# EAGLE design v.0.0.0 (EAGLE 5.11)

## Sheet 1 of 4
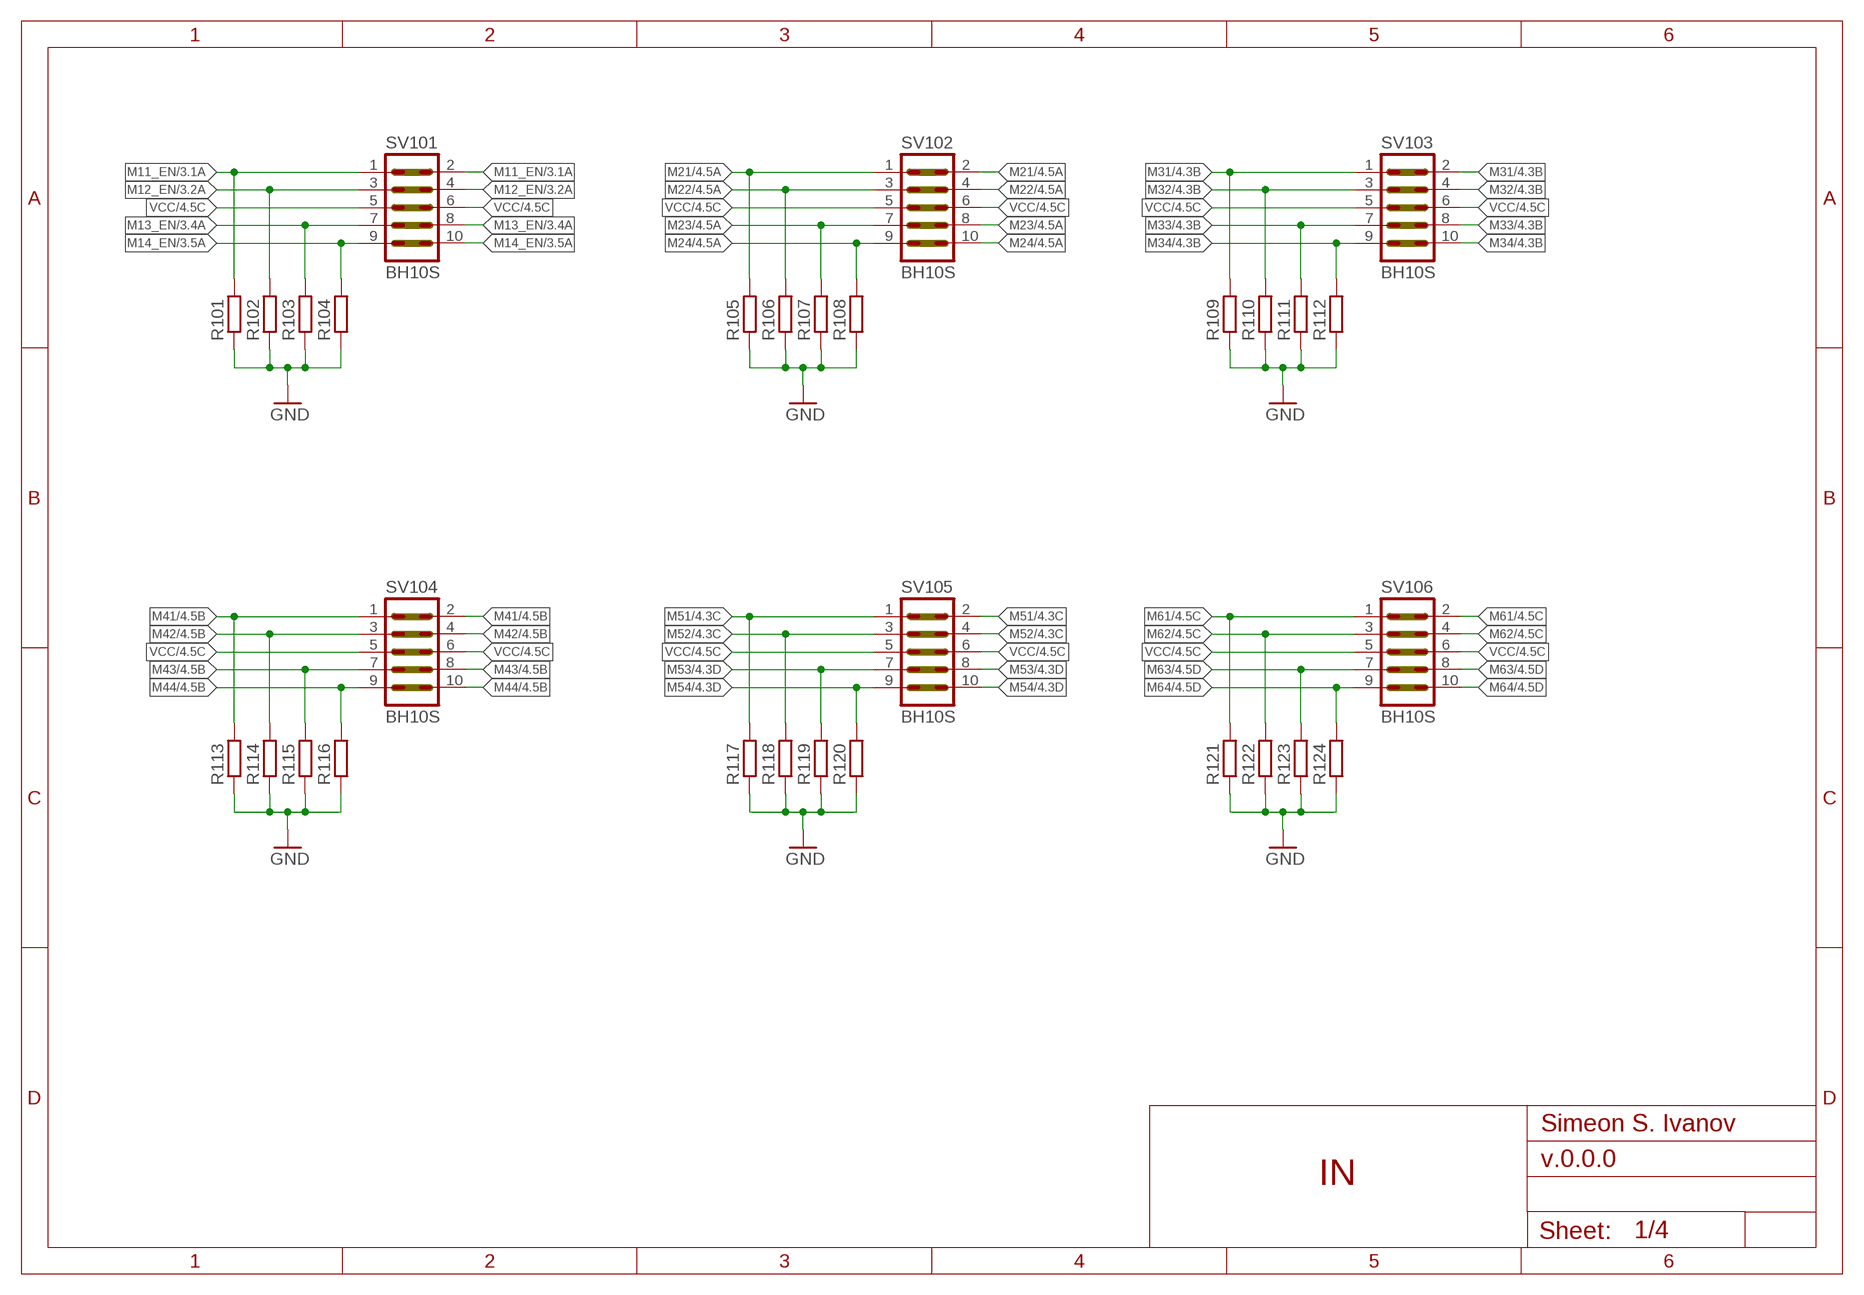
[diagram p0: schematic, sheet 1]

### Parts
R101  R-EU_0204/5  [0204/5]
R102  R-EU_0204/5  [0204/5]
R103  R-EU_0204/5  [0204/5]
R104  R-EU_0204/5  [0204/5]
R105  R-EU_0204/5  [0204/5]
R106  R-EU_0204/5  [0204/5]
R107  R-EU_0204/5  [0204/5]
R108  R-EU_0204/5  [0204/5]
R109  R-EU_0204/5  [0204/5]
R110  R-EU_0204/5  [0204/5]
R111  R-EU_0204/5  [0204/5]
R112  R-EU_0204/5  [0204/5]
R113  R-EU_0204/5  [0204/5]
R114  R-EU_0204/5  [0204/5]
R115  R-EU_0204/5  [0204/5]
R116  R-EU_0204/5  [0204/5]
R117  R-EU_0204/5  [0204/5]
R118  R-EU_0204/5  [0204/5]
R119  R-EU_0204/5  [0204/5]
R120  R-EU_0204/5  [0204/5]
R121  R-EU_0204/5  [0204/5]
R122  R-EU_0204/5  [0204/5]
R123  R-EU_0204/5  [0204/5]
R124  R-EU_0204/5  [0204/5]
SV101  BH10S  ML10M10-HOME  [M10-HOME]
SV102  BH10S  ML10M10-HOME  [M10-HOME]
SV103  BH10S  ML10M10-HOME  [M10-HOME]
SV104  BH10S  ML10M10-HOME  [M10-HOME]
SV105  BH10S  ML10M10-HOME  [M10-HOME]
SV106  BH10S  ML10M10-HOME  [M10-HOME]

### Nets
GND: R101.1 R102.1 R103.1 R104.1 R105.1 R106.1 R107.1 R108.1 R109.1 R110.1 R111.1 R112.1 R113.1 R114.1 R115.1 R116.1 R117.1 R118.1 R119.1 R120.1 R121.1 R122.1 R123.1 R124.1 ; also sheet 2,3,4
M11_EN: R101.2 SV101.1 SV101.2 ; also sheet 3
M12_EN: R102.2 SV101.3 SV101.4 ; also sheet 3
M13_EN: R103.2 SV101.7 SV101.8 ; also sheet 3
M14_EN: R104.2 SV101.9 SV101.10 ; also sheet 3
M21: R105.2 SV102.1 SV102.2 ; also sheet 4
M22: R106.2 SV102.3 SV102.4 ; also sheet 4
M23: R107.2 SV102.7 SV102.8 ; also sheet 4
M24: R108.2 SV102.9 SV102.10 ; also sheet 4
M31: R109.2 SV103.1 SV103.2 ; also sheet 4
M32: R110.2 SV103.3 SV103.4 ; also sheet 4
M33: R111.2 SV103.7 SV103.8 ; also sheet 4
M34: R112.2 SV103.9 SV103.10 ; also sheet 4
M41: R113.2 SV104.1 SV104.2 ; also sheet 4
M42: R114.2 SV104.3 SV104.4 ; also sheet 4
M43: R115.2 SV104.7 SV104.8 ; also sheet 4
M44: R116.2 SV104.9 SV104.10 ; also sheet 4
M51: R117.2 SV105.1 SV105.2 ; also sheet 4
M52: R118.2 SV105.3 SV105.4 ; also sheet 4
M53: R119.2 SV105.7 SV105.8 ; also sheet 4
M54: R120.2 SV105.9 SV105.10 ; also sheet 4
M61: R121.2 SV106.1 SV106.2 ; also sheet 4
M62: R122.2 SV106.3 SV106.4 ; also sheet 4
M63: R123.2 SV106.7 SV106.8 ; also sheet 4
M64: R124.2 SV106.9 SV106.10 ; also sheet 4
VCC: SV101.5 SV101.6 SV102.5 SV102.6 SV103.5 SV103.6 SV104.5 SV104.6 SV105.5 SV105.6 SV106.5 SV106.6 ; also sheet 4

### Notes on the sheet
- Simeon S. Ivanov
- IN

## Sheet 2 of 4
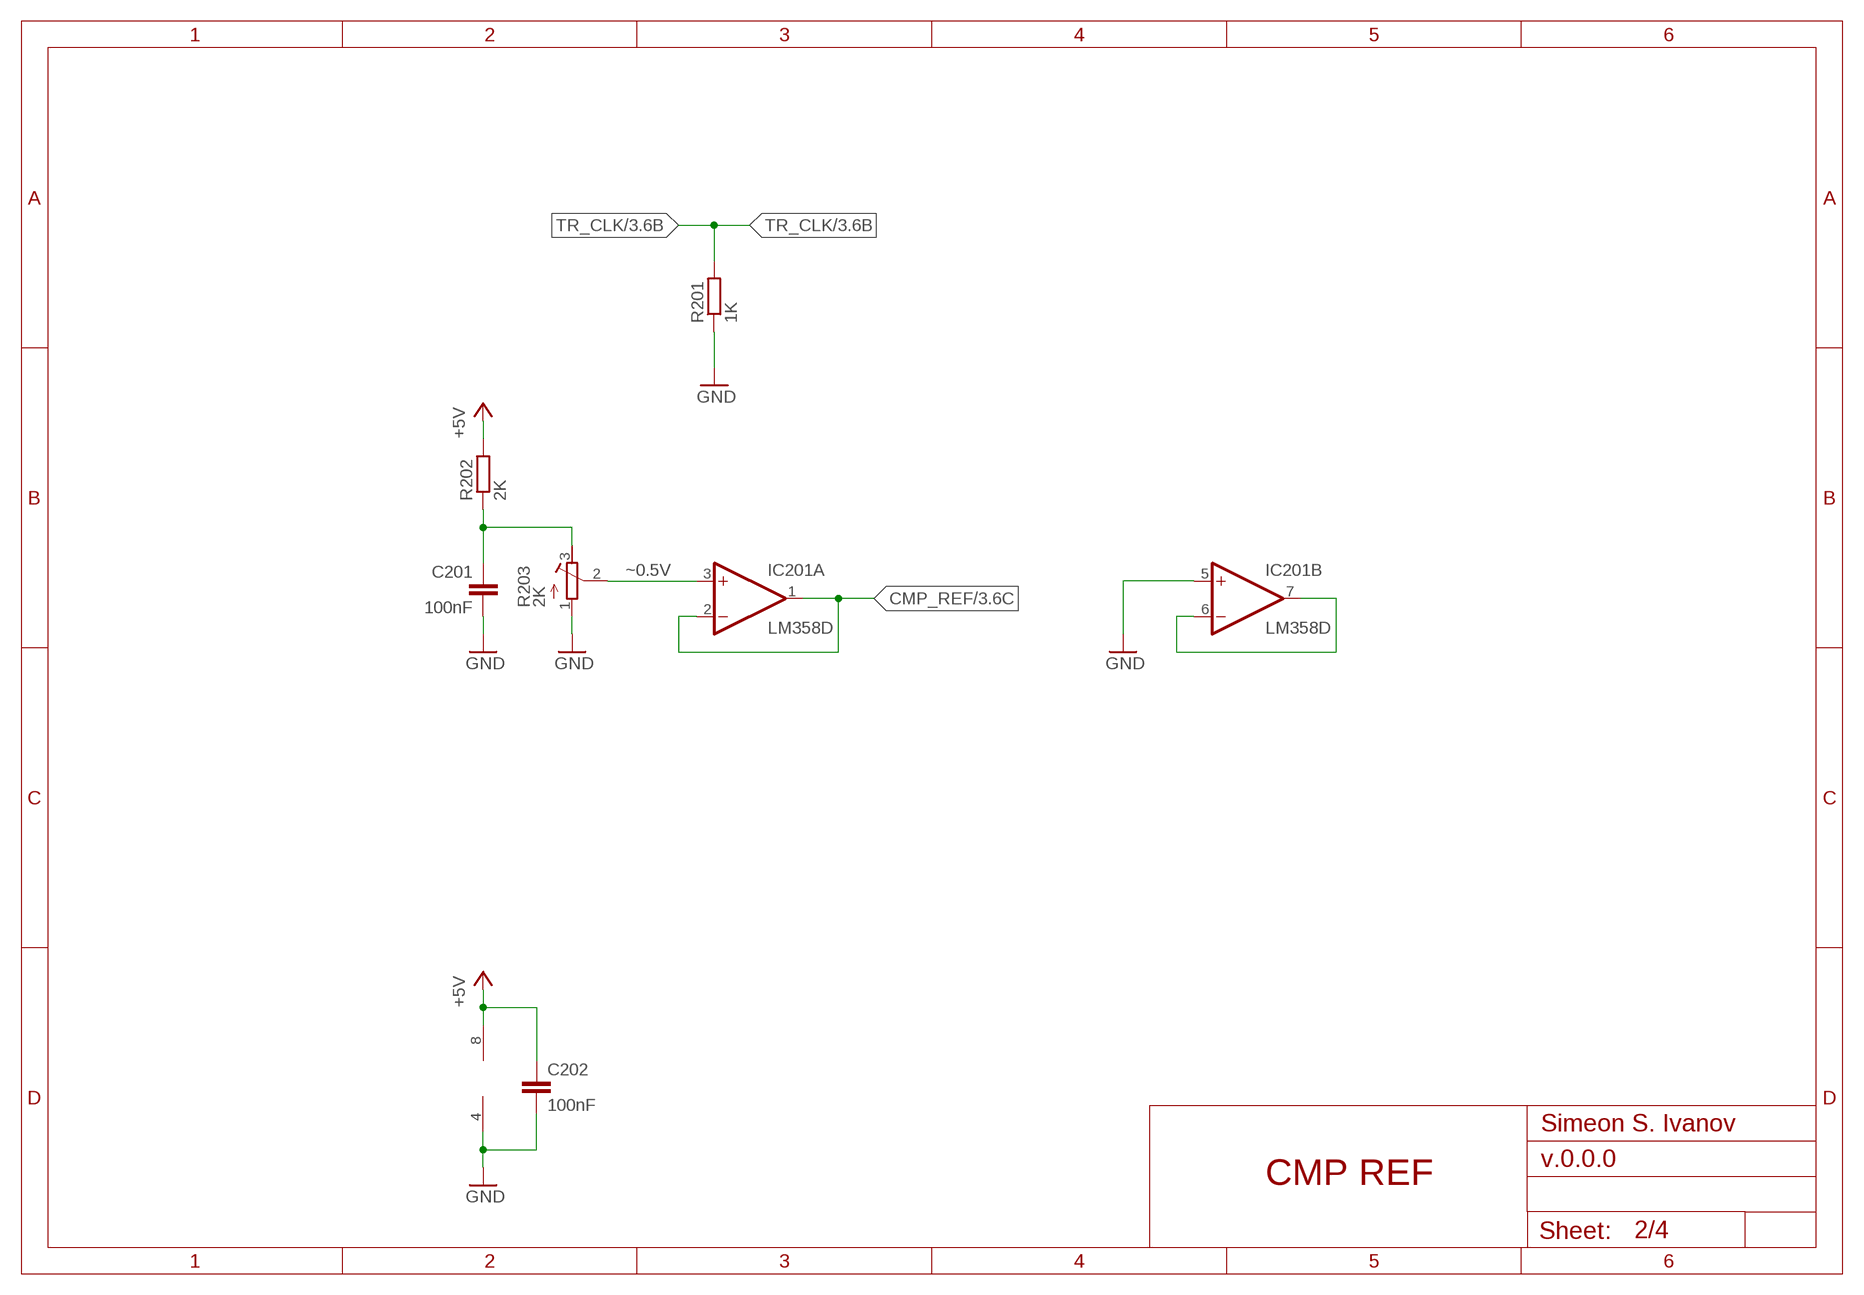
[diagram p1: schematic, sheet 2]

### Parts
C201  100nF  C-EUC1206  [C1206]
C202  100nF  C-EUC0603  [C0603]
IC201  LM358D  [SO08]
R201  1K  R-EU_0411/3V  [0411V]
R202  2K  R-EU_0204/5  [0204/5]
R203  2K  R-TRIMM3296W  [RTRIM3296W]

### Nets
+5V: C202.1 IC201.8(P:V+) R202.2 ; also sheet 3
CMP_REF: IC201.1(A:OUT) IC201.2(A:-IN) ; also sheet 3
GND: C201.2 C202.2 IC201.4(P:V-) IC201.5(B:+IN) R201.1 R203.1(E) ; also sheet 1,3,4
N$1: C201.1 R202.1 R203.3(A)
N$3: IC201.6(B:-IN) IC201.7(B:OUT)
TR_CLK: R201.2 ; also sheet 3
~0.5V: IC201.3(A:+IN) R203.2(S)

### Notes on the sheet
- Simeon S. Ivanov
- CMP REF

## Sheet 3 of 4
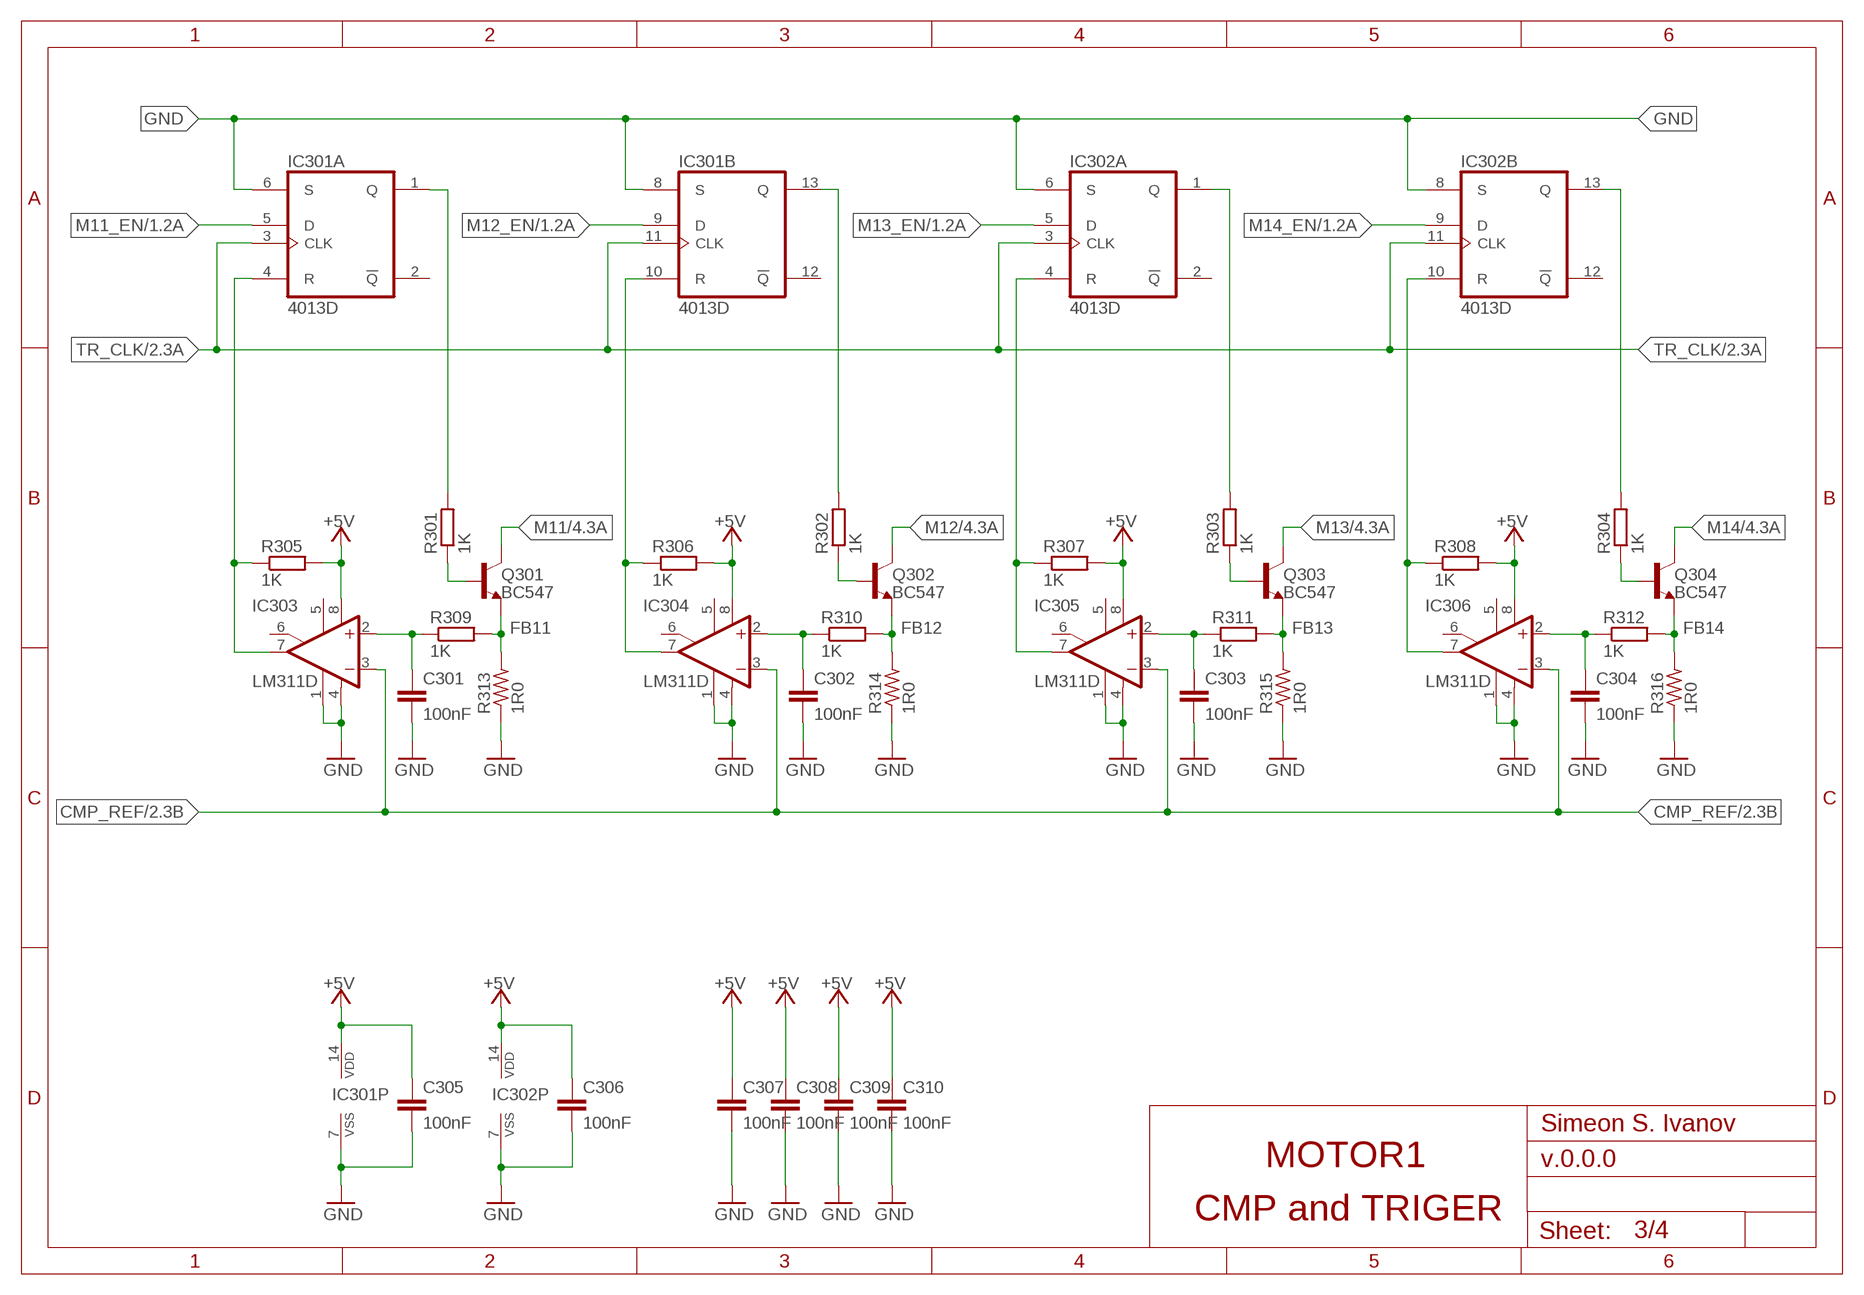
[diagram p2: schematic, sheet 3]

### Parts
C301  100nF  C-EUC0805  [C0805]
C302  100nF  C-EUC0805  [C0805]
C303  100nF  C-EUC0805  [C0805]
C304  100nF  C-EUC0805  [C0805]
C305  100nF  C-EUC0603  [C0603]
C306  100nF  C-EUC0603  [C0603]
C307  100nF  C-EUC0603  [C0603]
C308  100nF  C-EUC0603  [C0603]
C309  100nF  C-EUC0603  [C0603]
C310  100nF  C-EUC0603  [C0603]
IC301  4013D  [SO14]
IC302  4013D  [SO14]
IC303  LM311D  [SO08]
IC304  LM311D  [SO08]
IC305  LM311D  [SO08]
IC306  LM311D  [SO08]
Q301  BC547  [TO92]
Q302  BC547  [TO92]
Q303  BC547  [TO92]
Q304  BC547  [TO92]
R301  1K  R-EU_0204/5  [0204/5]
R302  1K  R-EU_0204/5  [0204/5]
R303  1K  R-EU_0204/5  [0204/5]
R304  1K  R-EU_0204/5  [0204/5]
R305  1K  R-EU_R0603  [R0603]
R306  1K  R-EU_R0603  [R0603]
R307  1K  R-EU_R0603  [R0603]
R308  1K  R-EU_R0603  [R0603]
R309  1K  R-EU_0204/2V  [0204V]
R310  1K  R-EU_0204/2V  [0204V]
R311  1K  R-EU_0204/2V  [0204V]
R312  1K  R-EU_0204/2V  [0204V]
R313  1R0  R-US_0204/5  [0204/5]
R314  1R0  R-US_0204/5  [0204/5]
R315  1R0  R-US_0204/5  [0204/5]
R316  1R0  R-US_0204/5  [0204/5]

### Nets
+5V: C305.1 C306.1 C307.1 C308.1 C309.1 C310.1 IC301.14(P:VDD) IC302.14(P:VDD) IC303.8(V+) IC304.8(V+) IC305.8(V+) IC306.8(V+) R305.2 R306.2 R307.2 R308.2 ; also sheet 2
CMP_REF: IC303.3(-IN) IC304.3(-IN) IC305.3(-IN) IC306.3(-IN) ; also sheet 2
FB11: Q301.1(E) R309.2 R313.2
FB12: Q302.1(E) R310.2 R314.2
FB13: Q303.1(E) R311.2 R315.2
FB14: Q304.1(E) R312.2 R316.2
GND: C301.2 C302.2 C303.2 C304.2 C305.2 C306.2 C307.2 C308.2 C309.2 C310.2 IC301.6(A:S) IC301.7(P:VSS) IC301.8(B:S) IC302.6(A:S) IC302.7(P:VSS) IC302.8(B:S) IC303.1(GND) IC303.4(V-) IC304.1(GND) IC304.4(V-) IC305.1(GND) IC305.4(V-) IC306.1(GND) IC306.4(V-) R313.1 R314.1 R315.1 R316.1 ; also sheet 1,2,4
M11: Q301.3(C) ; also sheet 4
M11_EN: IC301.5(A:D) ; also sheet 1
M12: Q302.3(C) ; also sheet 4
M12_EN: IC301.9(B:D) ; also sheet 1
M13: Q303.3(C) ; also sheet 4
M13_EN: IC302.5(A:D) ; also sheet 1
M14: Q304.3(C) ; also sheet 4
M14_EN: IC302.9(B:D) ; also sheet 1
N$5: IC301.10(B:R) IC304.7(OUT) R306.1
N$7: Q301.2(B) R301.1
N$8: IC301.13(B:Q) R302.2
N$9: IC301.1(A:Q) R301.2
N$10: IC301.4(A:R) IC303.7(OUT) R305.1
N$11: Q302.2(B) R302.1
N$12: Q304.2(B) R304.1
N$13: Q303.2(B) R303.1
N$14: IC302.13(B:Q) R304.2
N$15: IC302.10(B:R) IC306.7(OUT) R308.1
N$16: IC302.1(A:Q) R303.2
N$17: C304.1 IC306.2(+IN) R312.1
N$18: IC302.4(A:R) IC305.7(OUT) R307.1
N$19: C303.1 IC305.2(+IN) R311.1
N$20: C302.1 IC304.2(+IN) R310.1
N$22: C301.1 IC303.2(+IN) R309.1
TR_CLK: IC301.3(A:CLK) IC301.11(B:CLK) IC302.3(A:CLK) IC302.11(B:CLK) ; also sheet 2
Unconnected: IC301.2(A:!Q) IC301.12(B:!Q) IC302.2(A:!Q) IC302.12(B:!Q) IC303.5(ON) IC303.6(ON/STR) IC304.5(ON) IC304.6(ON/STR) IC305.5(ON) IC305.6(ON/STR) IC306.5(ON) IC306.6(ON/STR)

### Notes on the sheet
- Simeon S. Ivanov
- MOTOR1
- CMP and TRIGER

## Sheet 4 of 4
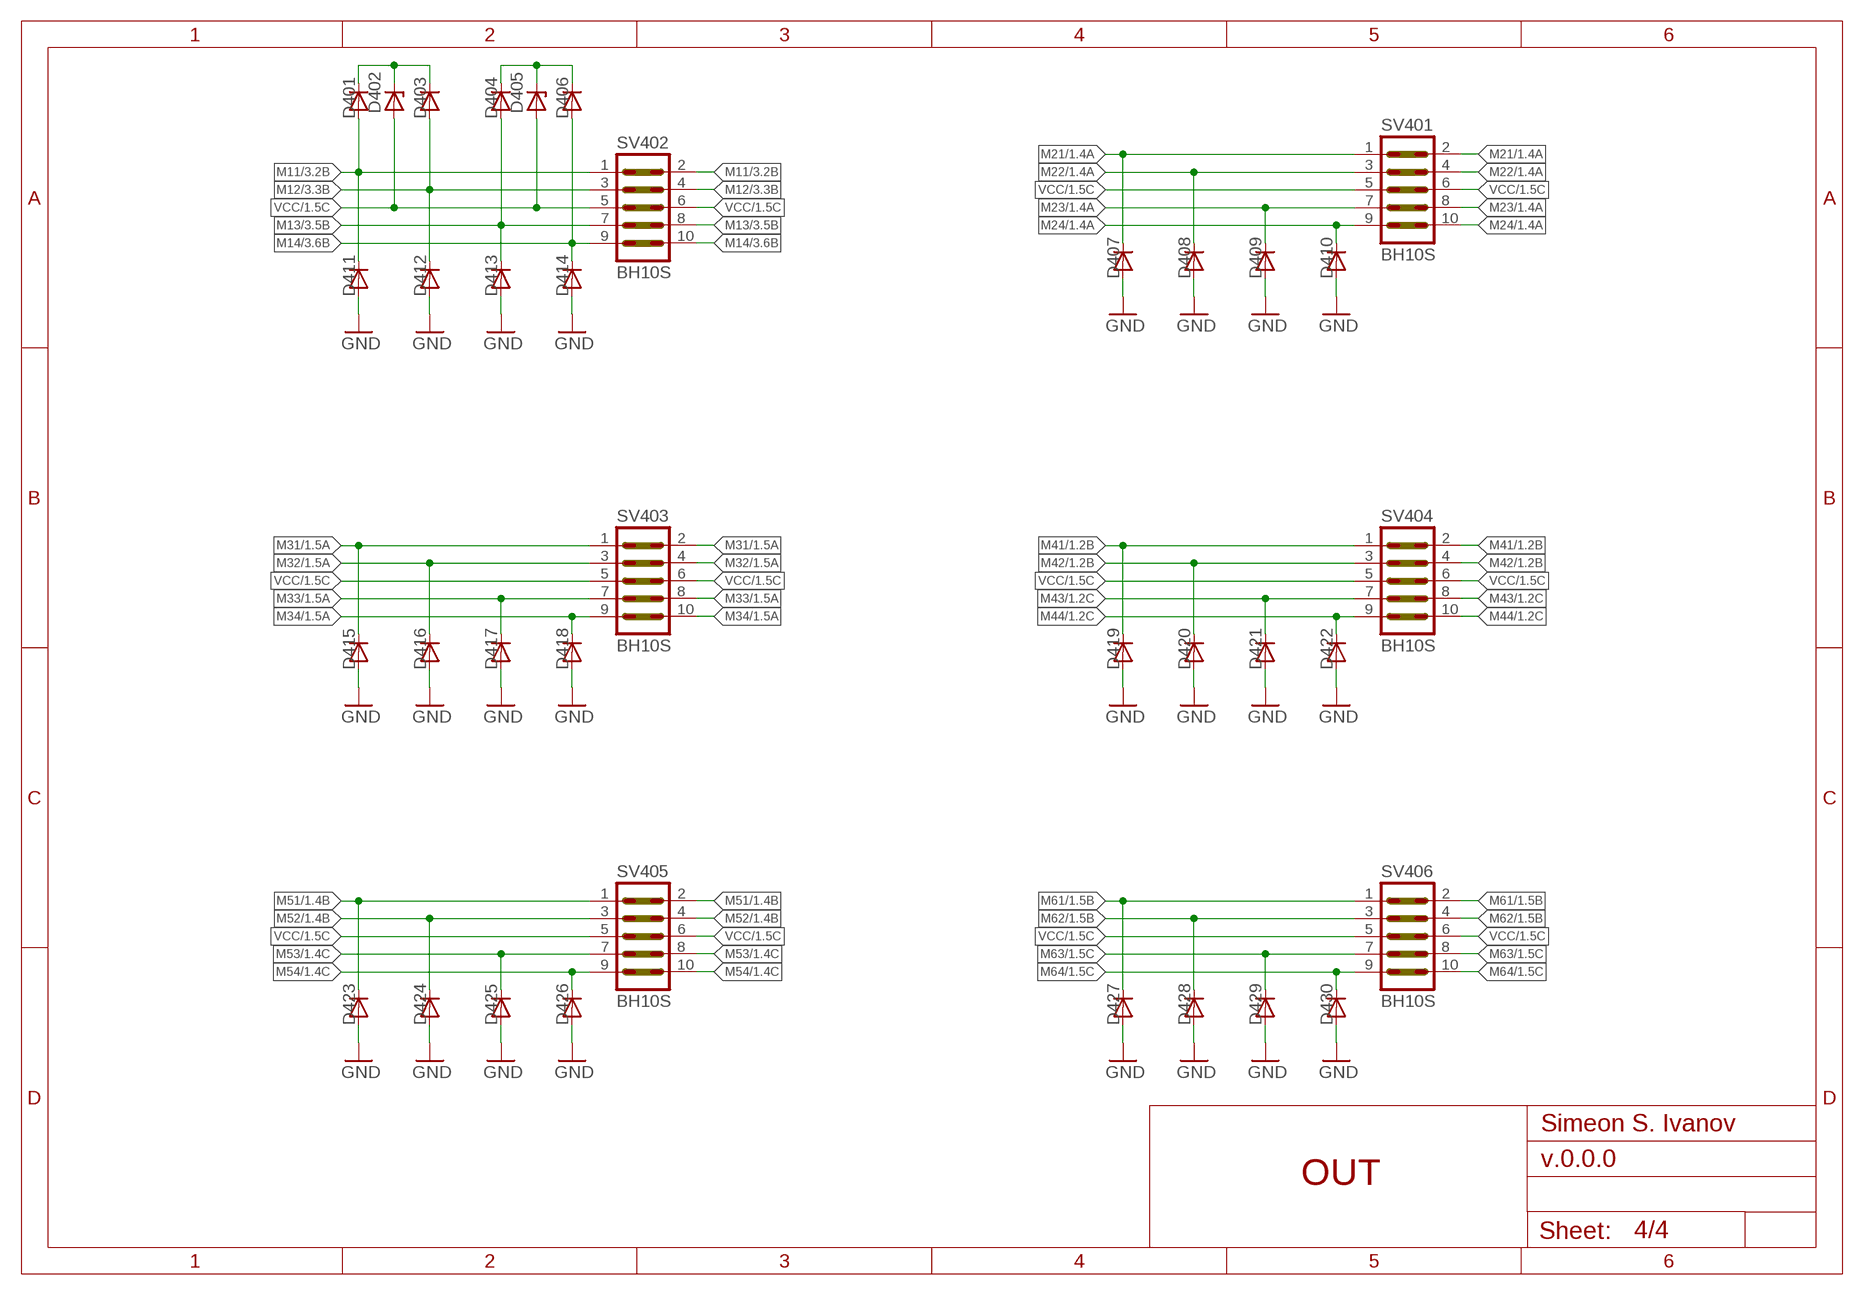
[diagram p3: schematic, sheet 4]

### Parts
D401  DIODE-D-2.5  [D-2.5]
D402  ZENER-DIODEZD-2.5  [ZDIO-2.5]
D403  DIODE-D-2.5  [D-2.5]
D404  DIODE-D-2.5  [D-2.5]
D405  ZENER-DIODEZD-2.5  [ZDIO-2.5]
D406  DIODE-D-2.5  [D-2.5]
D407  DIODE-D-2.5  [D-2.5]
D408  DIODE-D-2.5  [D-2.5]
D409  DIODE-D-2.5  [D-2.5]
D410  DIODE-D-2.5  [D-2.5]
D411  DIODE-D-2.5  [D-2.5]
D412  DIODE-D-2.5  [D-2.5]
D413  DIODE-D-2.5  [D-2.5]
D414  DIODE-D-2.5  [D-2.5]
D415  DIODE-D-2.5  [D-2.5]
D416  DIODE-D-2.5  [D-2.5]
D417  DIODE-D-2.5  [D-2.5]
D418  DIODE-D-2.5  [D-2.5]
D419  DIODE-D-2.5  [D-2.5]
D420  DIODE-D-2.5  [D-2.5]
D421  DIODE-D-2.5  [D-2.5]
D422  DIODE-D-2.5  [D-2.5]
D423  DIODE-D-2.5  [D-2.5]
D424  DIODE-D-2.5  [D-2.5]
D425  DIODE-D-2.5  [D-2.5]
D426  DIODE-D-2.5  [D-2.5]
D427  DIODE-D-2.5  [D-2.5]
D428  DIODE-D-2.5  [D-2.5]
D429  DIODE-D-2.5  [D-2.5]
D430  DIODE-D-2.5  [D-2.5]
SV401  BH10S  ML10M10-HOME  [M10-HOME]
SV402  BH10S  ML10M10-HOME  [M10-HOME]
SV403  BH10S  ML10M10-HOME  [M10-HOME]
SV404  BH10S  ML10M10-HOME  [M10-HOME]
SV405  BH10S  ML10M10-HOME  [M10-HOME]
SV406  BH10S  ML10M10-HOME  [M10-HOME]

### Nets
GND: D407.A D408.A D409.A D410.A D411.A D412.A D413.A D414.A D415.A D416.A D417.A D418.A D419.A D420.A D421.A D422.A D423.A D424.A D425.A D426.A D427.A D428.A D429.A D430.A ; also sheet 1,2,3
M11: D401.A D411.C SV402.1 SV402.2 ; also sheet 3
M12: D403.A D412.C SV402.3 SV402.4 ; also sheet 3
M13: D404.A D413.C SV402.7 SV402.8 ; also sheet 3
M14: D406.A D414.C SV402.9 SV402.10 ; also sheet 3
M21: D407.C SV401.1 SV401.2 ; also sheet 1
M22: D408.C SV401.3 SV401.4 ; also sheet 1
M23: D409.C SV401.7 SV401.8 ; also sheet 1
M24: D410.C SV401.9 SV401.10 ; also sheet 1
M31: D415.C SV403.1 SV403.2 ; also sheet 1
M32: D416.C SV403.3 SV403.4 ; also sheet 1
M33: D417.C SV403.7 SV403.8 ; also sheet 1
M34: D418.C SV403.9 SV403.10 ; also sheet 1
M41: D419.C SV404.1 SV404.2 ; also sheet 1
M42: D420.C SV404.3 SV404.4 ; also sheet 1
M43: D421.C SV404.7 SV404.8 ; also sheet 1
M44: D422.C SV404.9 SV404.10 ; also sheet 1
M51: D423.C SV405.1 SV405.2 ; also sheet 1
M52: D424.C SV405.3 SV405.4 ; also sheet 1
M53: D425.C SV405.7 SV405.8 ; also sheet 1
M54: D426.C SV405.9 SV405.10 ; also sheet 1
M61: D427.C SV406.1 SV406.2 ; also sheet 1
M62: D428.C SV406.3 SV406.4 ; also sheet 1
M63: D429.C SV406.7 SV406.8 ; also sheet 1
M64: D430.C SV406.9 SV406.10 ; also sheet 1
N$2: D401.C D402.C D403.C
N$4: D404.C D405.C D406.C
VCC: D402.A D405.A SV401.5 SV401.6 SV402.5 SV402.6 SV403.5 SV403.6 SV404.5 SV404.6 SV405.5 SV405.6 SV406.5 SV406.6 ; also sheet 1

### Notes on the sheet
- Simeon S. Ivanov
- OUT

## Library data of the parts
C201 C202 C301-C310 = rcl:C-EU: CAPACITOR, European symbol
D401 D403 D404 D406-D430 = diode:DIODE-: DIODE
D402 D405 = diode:ZENER-DIODE: Z-Diode
IC201 = linear:LM358: OP AMP also LM158; LM258; LM2904 Source: http://cache.national.com/ds/LM/LM158.pdf
IC301 IC302 = 40xx:4013: Dual D FLIP FLOP, set/reset
IC303-IC306 = linear:LM311: COMPARATOR
Q301-Q304 = transistor-npn:BC547*: NPN Transistor
R101-R124 R201 R202 R301-R312 = rcl:R-EU_: RESISTOR, European symbol
R203 = rcl:R-TRIMM: Trimm resistor
R313-R316 = rcl:R-US_: RESISTOR, American symbol
SV101-SV106 SV401-SV406 = con-harting-ml:ML10: HARTING

## Board
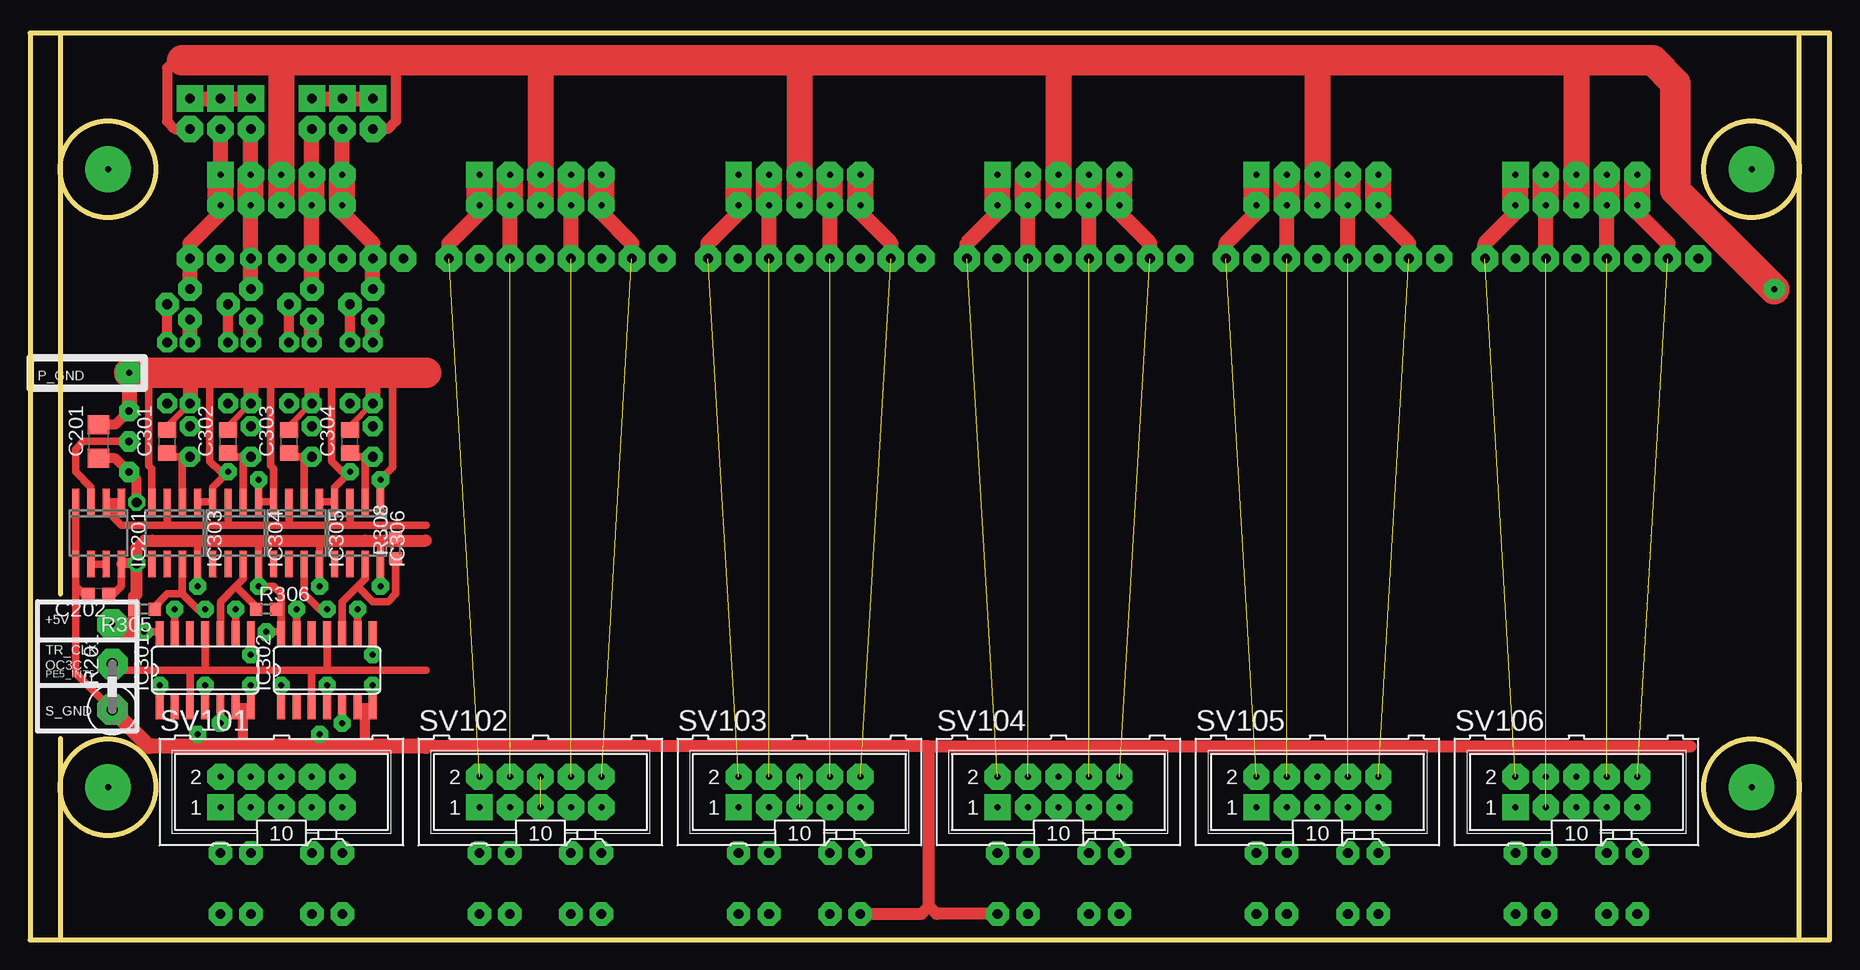
[diagram p4: board, top side]
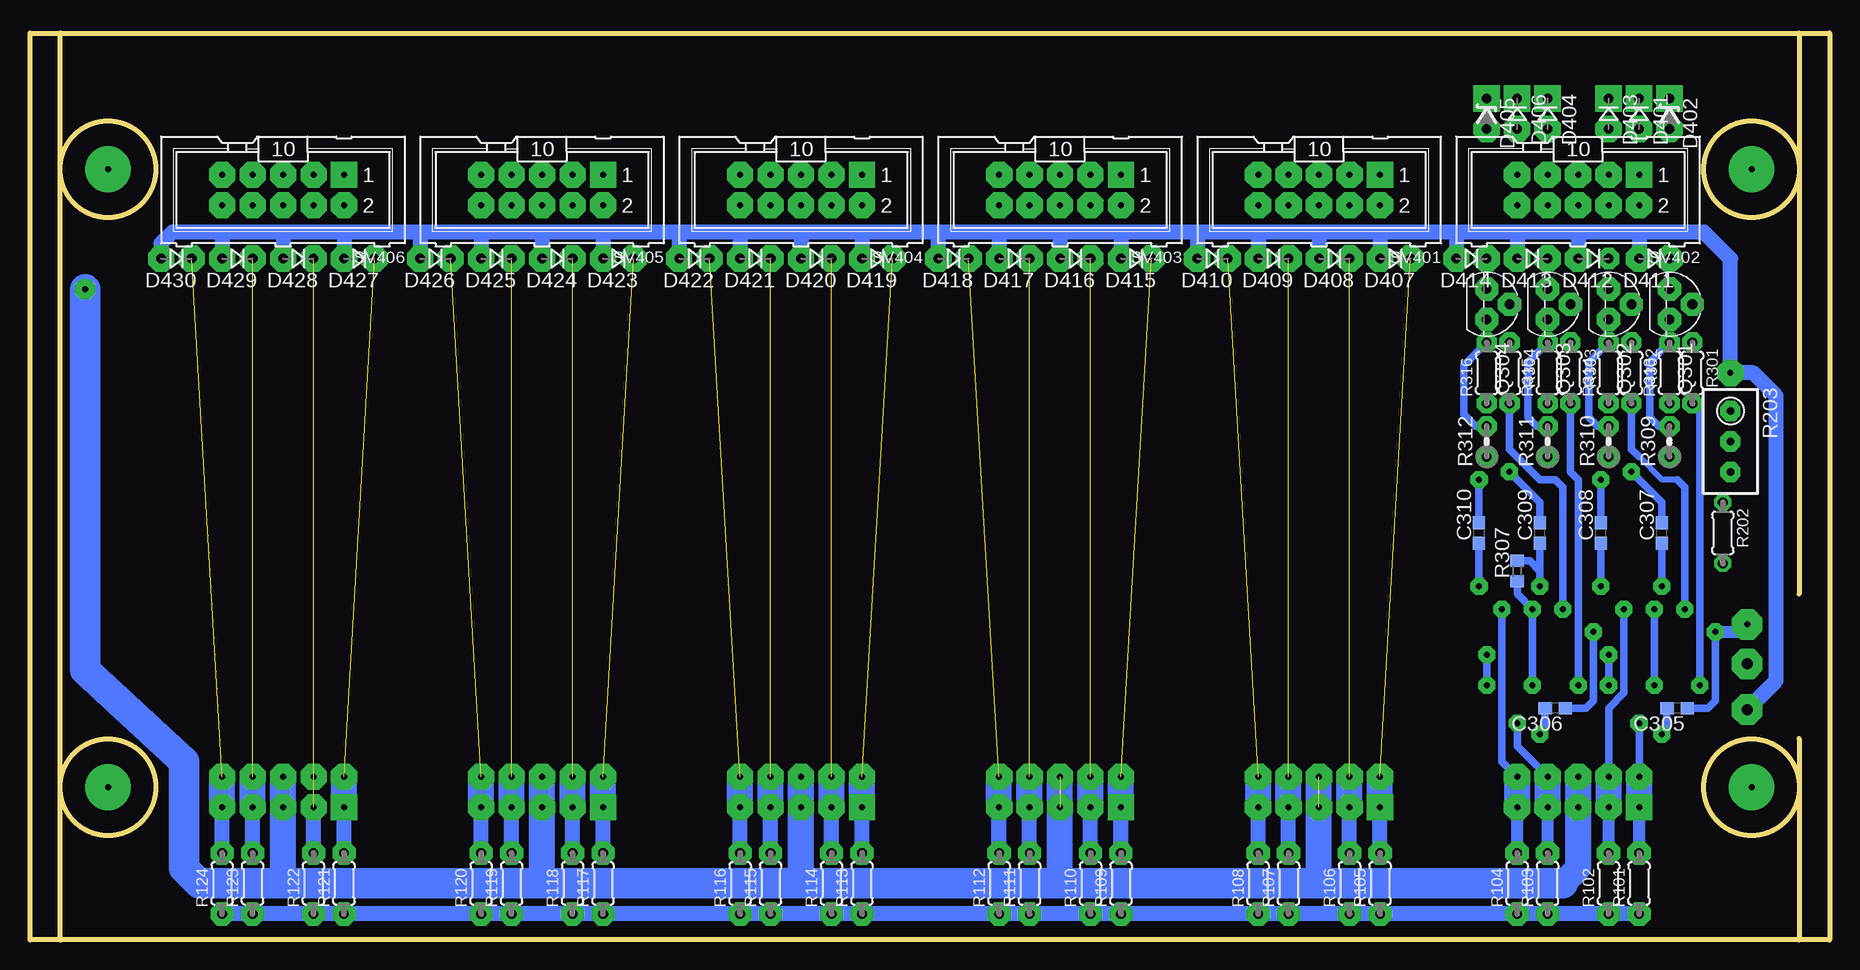
[diagram p5: board, bottom side, seen from below]

Size 150 x 75.57 mm. Coordinates in mm from the lower left corner, seen from the top.
Outline: 2.54,0 0,0 0,75.57 147.46,75.57
Outline: 2.54,0 147.46,0
Outline: 147.46,0 150,0 150,75.57 147.46,75.57
Outline: 147.46,0 147.46,75.57
Outline: 2.54,75.57 2.54,28.83
Outline: 2.54,16.76 2.54,0
Outline: circle at 6.5,12.71 radius 4
Outline: circle at 143.5,12.71 radius 4
Outline: circle at 6.5,64.22 radius 4
Outline: circle at 143.5,64.22 radius 4
Copper layers (1*16): Top 0.035mm / dielectric 1.5mm / Bottom 0.035mm
Design rules "default *": minimum track width 10mil, minimum drill 19mil, track to track 8mil, track to pad 8mil, pad to pad 8mil, via to via 8mil, smd to smd 8mil, copper to edge 40mil, drill to drill 8mil, minimum pad ring 10mil, minimum via ring 8mil, stop-mask expansion 4mil, vias tented up to drill 0mil, thermal gap 10mil

### Footprints (pad centres in the part's own frame; a part is rotated, then mirrored left to right if it is on the bottom)
C1206 = smd 1.6 x 1.8: 1 -1.4,0; 2 1.4,0
C0603 = smd 1.1 x 1: 1 -0.85,0; 2 0.85,0
C0805 = smd 1.3 x 1.5: 1 -0.95,0; 2 0.95,0
D-2.5 = drill 0.813 octagon: A 1.27,0; C -1.27,0
ZDIO-2.5 = drill 0.813 octagon: A 1.27,0; C -1.27,0
SO08 = smd 0.6 x 2.2: 1 -1.905,-2.6; 2 -0.635,-2.6; 3 0.635,-2.6; 4 1.905,-2.6; 5 1.905,2.6; 6 0.635,2.6; 7 -0.635,2.6; 8 -1.905,2.6
SO14 = smd 0.66 x 2.032: 1 -3.81,-3.073; 2 -2.54,-3.073; 3 -1.27,-3.073; 4 0,-3.073; 5 1.27,-3.073; 6 2.54,-3.073; 7 3.81,-3.073; 8 3.81,3.073; 9 2.54,3.073; 10 1.27,3.073; 11 0,3.073; 12 -1.27,3.073; 13 -2.54,3.073; 14 -3.81,3.073
TO92 = drill 0.813 octagon: 1 1.27,0; 2 0,1.905; 3 -1.27,0
0204/5 = drill 0.813 octagon: 1 -2.54,0; 2 2.54,0
0411V = drill 0.914 octagon: 1 -2.54,0; 2 1.27,0
RTRIM3296W = drill 0.61 round: 1 0,-2.54; 2 0,0; 3 0,2.54
R0603 = smd 1 x 1.1: 1 -0.85,0; 2 0.85,0
0204V = drill 0.813 octagon: 1 -1.27,0; 2 1.27,0
M10-HOME = drill 0.5 pad 2.184 square: 1 -5.08,-1.27 | drill 0.5 pad 2.184 octagon: 2 -5.08,1.27; 3 -2.54,-1.27; 4 -2.54,1.27; 5 0,-1.27; 6 0,1.27; 7 2.54,-1.27; 8 2.54,1.27; 9 5.08,-1.27; 10 5.08,1.27

### Placement (x,y rotation side)
C201  5.71,41.53 90 top
C202  5.71,28.83 180 top
C301  11.43,41.53 90 top
C302  16.51,41.53 90 top
C303  21.59,41.53 90 top
C304  26.67,41.53 90 top
C305  12.7,19.3 180 bottom
C306  22.86,19.3 180 bottom
C307  13.97,33.91 90 bottom
C308  19.05,33.91 90 bottom
C309  24.13,33.91 90 bottom
C310  29.21,33.91 90 bottom
D401  15.88,68.83 270 bottom
D402  13.34,68.83 270 bottom
D403  18.41,68.83 270 bottom
D404  23.5,68.83 270 bottom
D405  28.57,68.83 270 bottom
D406  26.04,68.83 270 bottom
D407  36.2,56.77 180 bottom
D408  41.27,56.77 180 bottom
D409  46.35,56.77 180 bottom
D410  51.44,56.77 180 bottom
D411  14.61,56.77 180 bottom
D412  19.68,56.77 180 bottom
D413  24.77,56.77 180 bottom
D414  29.84,56.77 180 bottom
D415  57.78,56.77 180 bottom
D416  62.87,56.77 180 bottom
D417  67.94,56.77 180 bottom
D418  73.03,56.77 180 bottom
D419  79.38,56.77 180 bottom
D420  84.45,56.77 180 bottom
D421  89.53,56.77 180 bottom
D422  94.61,56.77 180 bottom
D423  100.97,56.77 180 bottom
D424  106.05,56.77 180 bottom
D425  111.12,56.77 180 bottom
D426  116.2,56.77 180 bottom
D427  122.56,56.77 180 bottom
D428  127.64,56.77 180 bottom
D429  132.72,56.77 180 bottom
D430  137.79,56.77 180 bottom
IC201  5.71,33.91 180 top
IC301  14.61,22.48 0 top
IC302  24.77,22.48 0 top
IC303  12.06,33.91 180 top
IC304  17.14,33.91 180 top
IC305  22.23,33.91 180 top
IC306  27.3,33.91 180 top
Q301  13.34,52.96 270 bottom
Q302  18.41,52.96 270 bottom
Q303  23.5,52.96 270 bottom
Q304  28.57,52.96 270 bottom
R101  15.88,4.7 90 bottom
R102  18.41,4.7 90 bottom
R103  23.5,4.7 90 bottom
R104  26.04,4.7 90 bottom
R105  37.47,4.7 90 bottom
R106  40.01,4.7 90 bottom
R107  45.09,4.7 90 bottom
R108  47.62,4.7 90 bottom
R109  59.05,4.7 90 bottom
R110  61.59,4.7 90 bottom
R111  66.67,4.7 90 bottom
R112  69.22,4.7 90 bottom
R113  80.64,4.7 90 bottom
R114  83.19,4.7 90 bottom
R115  88.27,4.7 90 bottom
R116  90.81,4.7 90 bottom
R117  102.23,4.7 90 bottom
R118  104.78,4.7 90 bottom
R119  109.86,4.7 90 bottom
R120  112.39,4.7 90 bottom
R121  123.83,4.7 90 bottom
R122  126.36,4.7 90 bottom
R123  131.44,4.7 90 bottom
R124  133.99,4.7 90 bottom
R201  6.86,21.72 90 top
R202  8.89,33.91 270 bottom
R203  8.26,41.53 180 bottom
R301  11.43,47.24 270 bottom
R302  16.51,47.24 270 bottom
R303  21.59,47.24 270 bottom
R304  26.67,47.24 270 bottom
R305  9.53,27.56 180 top
R306  19.68,27.56 0 top
R307  26.04,30.73 90 bottom
R308  30.48,32.64 90 top
R309  13.34,41.53 90 bottom
R310  18.41,41.53 90 bottom
R311  23.5,41.53 90 bottom
R312  28.57,41.53 90 bottom
R313  13.34,47.24 90 bottom
R314  18.41,47.24 90 bottom
R315  23.5,47.24 90 bottom
R316  28.57,47.24 90 bottom
SV101  20.95,12.32 0 top
SV102  42.55,12.32 0 top
SV103  64.14,12.32 0 top
SV104  85.72,12.32 0 top
SV105  107.31,12.32 0 top
SV106  128.91,12.32 0 top
SV401  42.55,62.48 180 bottom
SV402  20.95,62.48 180 bottom
SV403  64.14,62.48 180 bottom
SV404  85.72,62.48 180 bottom
SV405  107.31,62.48 180 bottom
SV406  128.91,62.48 180 bottom

### Tracks (layer width: path | path; a pad name or v marks a point on that pad's centre or on a via)
+5V  (via drill 0.5 pad 1.42, 0.5 pad 2.54)
  Top 0.61: 13.97,33.27 19.05,33.27 | 24.13,33.27 19.05,33.27 | 27.94,33.27 24.13,33.27 | 24.13,33.27 IC305.8 v24.13,29.46 | 20.95,27.56 IC302.14 20.85,25.65 v19.68,25.65 | 20.95,27.56 20.95,28.83 20.32,29.46 v19.05,29.46 IC304.8 19.05,33.27 | 13.97,33.27 IC303.8 v13.97,29.46 | v29.21,29.46 IC306.8 C310.1 29.21,33.27 30.06,33.49 R308.2 | 20.95,27.56 R306.2 | v9.53,25.65 10.69,25.65 IC301.14 | C202.1 6.99,28.83 7.62,29.46 IC201.8 | 10.2,33.27 13.97,33.27
  Top 0.813: R202.2 7.68,31.37 IC201.8
  Top 1.016: 33.02,33.27 29.21,33.27 27.94,33.27 10.2,33.27 9.53,33.27 8.89,32.64 R202.2 8.89,28.83 8.68,28.61 R305.2 8.68,25.87 8.89,25.65 | v9.53,25.65 8.89,25.65 | 8.89,25.65 7.49,25.65 v6.86,26.29
  Bottom 0.61: v13.97,29.46 C307.1 | v19.05,29.46 C308.1 | C309.1 v24.13,29.46 24.13,30.73 24.98,31.58 R307.2 | v29.21,29.46 C310.1 | C306.1 20.32,19.3 19.68,19.94 v19.68,25.65 | C305.1 10.16,19.3 9.53,19.94 v9.53,25.65
  Bottom 1.016: v9.53,25.65 7.49,25.65 v6.86,26.29
  other vias: 8.89,31.37
CMP_REF
  Top 0.61: 11.43,34.54 IC303.3 | 11.43,34.54 16.51,34.54 | 16.51,34.54 21.59,34.54 | 21.59,34.54 26.67,34.54 | 26.67,34.54 33.02,34.54 | 26.67,34.54 IC306.3 | 21.59,34.54 IC305.3 | 16.51,34.54 IC304.3 | IC201.2 IC201.1 6.99,36.45 6.99,35.18 7.62,34.54 11.43,34.54
FB11  (via drill 0.5 pad 1.68, 0.5 pad 1.93)
  Top 1.27: R313.2 Q301.1
  Bottom 0.61: R313.2 14.99,48.13 14.99,44.45 14.99,43.56 14.22,42.8 R309.2
  other vias: 13.34,51.69 13.34,49.78 13.34,42.8
FB12  (via drill 0.5 pad 1.68, 0.5 pad 1.93)
  Top 1.27: R314.2 Q302.1
  Bottom 0.61: R314.2 20.07,48.13 20.07,44.45 20.07,43.56 19.3,42.8 R310.2
  other vias: 18.41,51.69 18.41,49.78 18.41,42.8
FB13  (via drill 0.5 pad 1.68, 0.5 pad 1.93)
  Top 1.27: R315.2 Q303.1
  Bottom 0.61: R315.2 25.15,48.13 25.15,44.45 25.15,43.56 24.38,42.8 R311.2
  other vias: 23.5,51.69 23.5,49.78 23.5,42.8
FB14  (via drill 0.5 pad 1.68, 0.5 pad 1.93)
  Top 1.27: R316.2 Q304.1
  Bottom 0.61: R316.2 30.48,47.88 30.48,44.7 30.48,43.81 29.46,42.8 R312.2
  other vias: 28.57,51.69 28.57,49.78 28.57,42.8
GND  (via drill 0.5 pad 1.42, 0.5 pad 1.68, 0.5 pad 1.93, 0.5 pad 2.18, 0.5 pad 2.54)
  Top 0.508: R313.1 11.43,42.8 | R315.1 21.59,42.8 | R316.1 26.67,42.8 | R314.1 16.51,42.8
  Top 0.61: IC303.4 10.16,39.24 9.91,39.5 9.91,47.12 10.03,47.24 13.34,47.24 | 19.05,47.24 20.19,47.24 | 25.4,47.24 23.5,47.24 20.19,47.24 | 25.4,47.24 28.57,47.24 29.21,47.24 | 20.19,47.24 20.07,47.12 20.07,39.5 20.32,39.24 IC305.4 IC304.1 v19.05,38.35 | 25.4,47.24 25.4,46.86 25.15,46.61 25.15,39.88 26.04,38.99 v26.67,38.99 25.4,37.72 IC306.4 IC305.1 | IC302.7 IC302.6 | v28.57,23.75 IC302.8 28.57,25.65 | IC302.7 v28.57,21.21 | v18.41,21.21 IC301.7 IC301.6 17.68,19.41 17.78,19.3 | v18.41,23.75 IC301.8 | IC302.7 28.04,19.41 27.94,19.3 | 14.03,36.51 IC303.1 IC304.4 15.24,37.72 v16.51,38.99 15.88,38.99 14.99,39.88 14.99,47.24 | 11.43,42.8 C301.2 | 21.59,42.8 C303.2 | 26.67,42.8 C304.2 | v29.21,38.35 IC306.1 | v29.21,38.35 30.23,39.37 30.23,47.24 | v29.21,38.35 29.21,36.45 | 3.81,29.46 4.45,28.83 C202.2 | 16.51,42.8 C302.2 | 3.81,29.46 3.81,22.23 R201.1 | 3.81,29.46 IC201.5 IC201.4
  Top 0.813: 17.78,16.13 17.78,19.3 | 27.94,16.13 27.94,19.3 | 31.11,47.24 30.48,47.88 | C201.2 7.12,42.93 R203.1
  Top 1.016: 74.93,16.13 33.02,16.13 | 74.93,16.13 138.43,16.13 | 74.93,2.79 74.93,16.13 | 74.93,2.79 74.3,2.16 R112.1 | 74.93,2.79 75.56,2.16 R113.1
  Top 1.27: 24.13,16.13 17.78,16.13 13.97,16.13 | 24.13,16.13 27.94,16.13 33.02,16.13 | 13.34,47.24 R313.1 | 23.5,47.24 R315.1 | 28.57,47.24 R316.1 | R201.1 9.91,16.13 13.97,16.13 | 24.13,16.13 v24.13,17.14 | 13.97,16.13 v13.97,17.14 | R314.1 18.41,46.61 19.05,47.24 | v8.26,47.24 R203.1
  Top 2.54: v8.26,47.24 13.34,47.24 14.99,47.24 19.05,47.24 23.5,47.24 28.57,47.24 30.23,47.24 31.11,47.24 33.02,47.24
  Bottom 0.61: v18.41,21.21 v18.41,23.75 | v28.57,21.21 v28.57,23.75 | v19.05,38.35 C308.2 | v29.21,38.35 C310.2 | C306.2 23.71,17.57 v24.13,17.14 | C305.2 13.55,17.57 v13.97,17.14 | C307.2 13.97,36.45 v16.51,38.99 | C309.2 24.13,36.45 v26.67,38.99
  Bottom 1.016: R101.1 R102.1 R103.1 R104.1
  Bottom 1.27: 15.88,58.98 10.47,58.98 8.26,56.77 v8.26,47.24 6.35,47.24 4.45,45.34 4.45,21.59 R201.1 | 15.88,58.98 20.95,58.98 | 20.95,58.98 26.04,58.98 | 26.04,58.98 31.11,58.98 | 31.11,58.98 37.47,58.98 | 37.47,58.98 42.55,58.98 | 42.55,58.98 47.62,58.98 | 47.62,58.98 52.7,58.98 | 52.7,58.98 59.05,58.98 | 59.05,58.98 64.14,58.98 | 64.14,58.98 69.22,58.98 | 69.22,58.98 74.3,58.98 | 74.3,58.98 80.64,58.98 | 80.64,58.98 85.72,58.98 | 85.72,58.98 90.81,58.98 | 90.81,58.98 95.89,58.98 | 95.89,58.98 102.23,58.98 | 102.23,58.98 107.31,58.98 | 107.31,58.98 112.39,58.98 | 112.39,58.98 117.47,58.98 | 117.47,58.98 123.83,58.98 | 123.83,58.98 128.91,58.98 | 128.91,58.98 133.99,58.98 | 20.95,58.98 D412.A | 15.88,58.98 D411.A | 26.04,58.98 D413.A | 31.11,58.98 D414.A | 133.99,58.98 D429.A | 128.91,58.98 D428.A | 123.83,58.98 D427.A | 117.47,58.98 D426.A | 112.39,58.98 D425.A | 107.31,58.98 D424.A | 102.23,58.98 D423.A | 95.89,58.98 v95.89,56.77 | 90.81,58.98 v90.81,56.77 | 85.72,58.98 D420.A | 80.64,58.98 D419.A | 74.3,58.98 D418.A | 69.22,58.98 v69.22,56.77 | 64.14,58.98 D416.A | 59.05,58.98 D415.A | 52.7,58.98 v52.7,56.77 | 47.62,58.98 D409.A | 42.55,58.98 D408.A | 37.47,58.98 D407.A | 133.99,58.98 138.12,58.98 139.06,58.04 D430.A | R101.1 R104.1 R105.1 R106.1 R107.1 R108.1 R109.1 R110.1 R111.1 R112.1 R113.1 R114.1 R115.1 R116.1 R117.1 R118.1 R119.1 R120.1 R121.1 R122.1 R123.1 R124.1
  other vias: 13.34,44.7 18.41,44.7 23.5,44.7 28.57,44.7 15.88,56.77 20.95,56.77 26.04,56.77 31.11,56.77 8.26,44.07 6.86,19.18 37.47,56.77 42.55,56.77 47.62,56.77 59.05,56.77 64.14,56.77 74.3,56.77 80.64,56.77 85.72,56.77 102.23,56.77 107.31,56.77 112.39,56.77 117.47,56.77 123.83,56.77 128.91,56.77 133.99,56.77 139.06,56.77 15.88,2.16 18.41,2.16 23.5,2.16 26.04,2.16 37.47,2.16 40.01,2.16 45.09,2.16 47.62,2.16 59.05,2.16 61.59,2.16 66.67,2.16 69.22,2.16 80.64,2.16 83.19,2.16 88.27,2.16 90.81,2.16 102.23,2.16 104.78,2.16 109.86,2.16 112.39,2.16 123.83,2.16 126.36,2.16 131.44,2.16 133.99,2.16
M11  (via drill 0.5 pad 1.93, 0.5 pad 2.18)
  Top 1.27: SV402.2 15.88,60.58 13.34,58.04 D411.C Q301.3 | SV402.1 D401.A
  Top 2.184: SV402.2 SV402.1
  other vias: 13.34,54.23 13.34,56.77 15.88,67.56
M11_EN  (via drill 0.5 pad 1.42, 0.5 pad 1.93)
  Top 0.61: v15.88,18.03 IC301.5
  Bottom 0.61: SV101.2 v15.88,18.03
  Bottom 1.016: R101.2 SV101.1
  Bottom 2.184: SV101.1 SV101.2
  other vias: 15.88,7.24
M12  (via drill 0.5 pad 1.78, 0.5 pad 1.93, 0.5 pad 2.18)
  Top 1.27: Q302.3 D412.C SV402.4 | SV402.3 D403.A
  Top 2.184: SV402.4 SV402.3
  other vias: 18.41,54.23 18.41,56.77 18.41,67.56
M12_EN  (via drill 0.5 pad 1.42, 0.5 pad 1.93)
  Top 0.61: v17.14,27.56 IC301.9
  Bottom 0.61: SV101.4 18.41,19.3 17.14,20.57 v17.14,27.56
  Bottom 1.016: R102.2 SV101.3
  Bottom 2.184: SV101.3 SV101.4
  other vias: 18.41,7.24
M13  (via drill 0.5 pad 1.93, 0.5 pad 2.18)
  Top 1.27: Q303.3 D413.C SV402.8 | SV402.7 D404.A
  Top 2.184: SV402.8 SV402.7
  other vias: 23.5,54.23 23.5,56.77 23.5,67.56
M13_EN  (via drill 0.5 pad 1.42, 0.5 pad 1.93)
  Top 0.61: v26.04,18.03 IC302.5
  Bottom 0.61: SV101.8 26.04,16.13 v26.04,18.03
  Bottom 1.016: R103.2 SV101.7
  Bottom 2.184: SV101.7 SV101.8
  other vias: 23.5,7.24
M14  (via drill 0.5 pad 1.93, 0.5 pad 2.18)
  Top 1.27: SV402.10 26.04,60.58 28.57,58.04 D414.C Q304.3 | SV402.9 D406.A
  Top 2.184: SV402.10 SV402.9
  other vias: 28.57,54.23 28.57,56.77 26.04,67.56
M14_EN  (via drill 0.5 pad 1.42, 0.5 pad 1.93)
  Top 0.61: v27.3,27.56 IC302.9
  Bottom 0.61: SV101.10 27.3,14.86 v27.3,27.56
  Bottom 1.016: R104.2 SV101.9
  Bottom 2.184: SV101.9 SV101.10
  other vias: 26.04,7.24
M21  (via drill 0.5 pad 1.93, 0.5 pad 2.18)  (1 unrouted)
  Top 1.27: SV401.2 37.47,60.58 34.92,58.04 D407.C
  Top 2.184: SV401.2 SV401.1
  Bottom 1.27: R105.2 SV102.1
  Bottom 2.184: SV102.1 SV102.2
  other vias: 34.92,56.77 37.47,7.24
M22  (via drill 0.5 pad 1.93, 0.5 pad 2.18)  (1 unrouted)
  Top 1.27: v40.01,56.77 SV401.4
  Top 2.184: SV401.4 SV401.3
  Bottom 1.27: R106.2 SV102.3
  Bottom 2.184: SV102.3 SV102.4
  other vias: 40.01,7.24
M23  (via drill 0.5 pad 1.93, 0.5 pad 2.18)  (1 unrouted)
  Top 1.27: v45.09,56.77 SV401.8
  Top 2.184: SV401.8 SV401.7
  Bottom 1.27: R107.2 SV102.7
  Bottom 2.184: SV102.7 SV102.8
  other vias: 45.09,7.24
M24  (via drill 0.5 pad 1.93, 0.5 pad 2.18)  (1 unrouted)
  Top 1.27: SV401.10 47.62,60.58 50.16,58.04 D410.C
  Top 2.184: SV401.10 SV401.9
  Bottom 1.27: R108.2 SV102.9
  Bottom 2.184: SV102.9 SV102.10
  other vias: 50.16,56.77 47.62,7.24
M31  (via drill 0.5 pad 1.93, 0.5 pad 2.18)  (1 unrouted)
  Top 1.27: SV403.2 59.05,60.58 56.52,58.04 v56.52,56.77
  Top 2.184: SV403.2 SV403.1
  Bottom 1.27: R109.2 SV103.1
  Bottom 2.184: SV103.1 SV103.2
  other vias: 59.05,7.24
M32  (via drill 0.5 pad 1.93, 0.5 pad 2.18)  (1 unrouted)
  Top 1.27: D416.C SV403.4
  Top 2.184: SV403.4 SV403.3
  Bottom 1.27: R110.2 SV103.3
  Bottom 2.184: SV103.3 SV103.4
  other vias: 61.59,56.77 61.59,7.24
M33  (via drill 0.5 pad 1.93, 0.5 pad 2.18)  (1 unrouted)
  Top 1.27: D417.C SV403.8
  Top 2.184: SV403.8 SV403.7
  Bottom 1.27: R111.2 SV103.7
  Bottom 2.184: SV103.7 SV103.8
  other vias: 66.67,56.77 66.67,7.24
M34  (via drill 0.5 pad 1.93, 0.5 pad 2.18)  (1 unrouted)
  Top 1.27: SV403.10 69.22,60.58 71.75,58.04 v71.75,56.77
  Top 2.184: SV403.10 SV403.9
  Bottom 1.27: R112.2 SV103.9
  Bottom 2.184: SV103.9 SV103.10
  other vias: 69.22,7.24
M41  (via drill 0.5 pad 1.93, 0.5 pad 2.18)  (1 unrouted)
  Top 1.27: SV404.2 80.64,60.58 78.11,58.04 D419.C
  Top 2.184: SV404.2 SV404.1
  Bottom 1.27: R113.2 SV104.1
  Bottom 2.184: SV104.1 SV104.2
  other vias: 78.11,56.77 80.64,7.24
M42  (via drill 0.5 pad 1.93, 0.5 pad 2.18)  (1 unrouted)
  Top 1.27: D420.C SV404.4
  Top 2.184: SV404.4 SV404.3
  Bottom 1.27: R114.2 SV104.3
  Bottom 2.184: SV104.3 SV104.4
  other vias: 83.19,56.77 83.19,7.24
M43  (via drill 0.5 pad 1.93, 0.5 pad 2.18)  (1 unrouted)
  Top 1.27: D421.C SV404.8
  Top 2.184: SV404.8 SV404.7
  Bottom 1.27: R115.2 SV104.7
  Bottom 2.184: SV104.7 SV104.8
  other vias: 88.27,56.77 88.27,7.24
M44  (via drill 0.5 pad 1.93, 0.5 pad 2.18)  (1 unrouted)
  Top 1.27: SV404.10 90.81,60.58 93.34,58.04 D422.C
  Top 2.184: SV404.10 SV404.9
  Bottom 1.27: R116.2 SV104.9
  Bottom 2.184: SV104.9 SV104.10
  other vias: 93.34,56.77 90.81,7.24
M51  (via drill 0.5 pad 1.93, 0.5 pad 2.18)  (1 unrouted)
  Top 1.27: SV405.2 102.23,60.58 99.69,58.04 v99.69,56.77
  Top 2.184: SV405.2 SV405.1
  Bottom 1.27: R117.2 SV105.1
  Bottom 2.184: SV105.1 SV105.2
  other vias: 102.23,7.24
M52  (via drill 0.5 pad 1.93, 0.5 pad 2.18)  (1 unrouted)
  Top 1.27: D424.C SV405.4
  Top 2.184: SV405.4 SV405.3
  Bottom 1.27: R118.2 SV105.3
  Bottom 2.184: SV105.3 SV105.4
  other vias: 104.78,56.77 104.78,7.24
M53  (via drill 0.5 pad 1.93, 0.5 pad 2.18)  (1 unrouted)
  Top 1.27: D425.C SV405.8
  Top 2.184: SV405.8 SV405.7
  Bottom 1.27: R119.2 SV105.7
  Bottom 2.184: SV105.7 SV105.8
  other vias: 109.86,56.77 109.86,7.24
M54  (via drill 0.5 pad 1.93, 0.5 pad 2.18)  (1 unrouted)
  Top 1.27: SV405.10 112.39,60.58 114.94,58.04 D426.C
  Top 2.184: SV405.10 SV405.9
  Bottom 1.27: R120.2 SV105.9
  Bottom 2.184: SV105.9 SV105.10
  other vias: 114.94,56.77 112.39,7.24
M61  (via drill 0.5 pad 1.93, 0.5 pad 2.18)  (1 unrouted)
  Top 1.27: SV406.2 123.83,60.58 121.28,58.04 v121.28,56.77
  Top 2.184: SV406.2 SV406.1
  Bottom 1.27: R121.2 SV106.1
  Bottom 2.184: SV106.1 SV106.2
  other vias: 123.83,7.24
M62  (via drill 0.5 pad 1.93, 0.5 pad 2.18)  (2 unrouted)
  Top 1.27: v126.36,56.77 SV406.4
  Top 2.184: SV406.4 SV406.3
  Bottom 1.27: R122.2 SV106.3
  other vias: 126.36,7.24
M63  (via drill 0.5 pad 1.93, 0.5 pad 2.18)  (1 unrouted)
  Top 1.27: D429.C SV406.8
  Top 2.184: SV406.8 SV406.7
  Bottom 1.27: R123.2 SV106.7
  Bottom 2.184: SV106.7 SV106.8
  other vias: 131.44,56.77 131.44,7.24
M64  (via drill 0.5 pad 1.93, 0.5 pad 2.18)  (1 unrouted)
  Top 1.27: SV406.10 133.99,60.58 136.53,58.04 v136.53,56.77
  Top 2.184: SV406.10 SV406.9
  Bottom 1.27: R124.2 SV106.9
  Bottom 2.184: SV106.9 SV106.10
  other vias: 133.99,7.24
N$1  (via drill 0.5 pad 1.42, 0.5 pad 1.68)
  Top 0.813: C201.1 7.12,40.13 R203.3 8.89,38.35 R202.1
  other vias: 8.26,38.99 8.89,36.45
N$2  (via drill 0.5 pad 2.18)
  Top 1.27: D403.C D401.C D402.C
  other vias: 18.41,70.1 15.88,70.1 13.34,70.1
N$3
  Top 0.61: IC201.7 IC201.6
N$4  (via drill 0.5 pad 2.18)
  Top 1.27: D404.C D406.C D405.C
  other vias: 26.04,70.1 23.5,70.1 28.57,70.1
N$5
  Top 0.61: IC301.10 15.88,28.19 17.14,29.46 | 17.14,29.46 17.78,30.1 IC304.7 | R306.1 18.84,27.77 17.14,29.46
N$7  (via drill 0.5 pad 1.68, 0.5 pad 1.93)
  Top 0.813: R301.1 Q301.2
  other vias: 11.43,49.78 11.43,52.96
N$8  (via drill 0.5 pad 1.42, 0.5 pad 1.68)
  Top 0.61: IC301.13 v12.06,27.56
  Bottom 0.508: 12.7,38.35 13.97,38.35 15.88,40.26
  Bottom 0.61: v12.06,27.56 12.06,37.72 12.7,38.35 | 15.88,40.26 16.51,40.89 R302.2
  other vias: 16.51,44.7
N$9  (via drill 0.5 pad 1.42, 0.5 pad 1.68)
  Top 0.61: IC301.1 v10.79,21.21
  Bottom 0.61: v10.79,21.21 10.79,44.07 R301.2
  other vias: 11.43,44.7
N$10  (via drill 0.5 pad 1.42)
  Top 0.61: 12.7,28.83 IC303.7 | v14.61,27.56 13.97,27.56 12.7,28.83 | IC301.4 v14.61,21.21 | R305.1 10.38,27.77 11.43,28.83 12.7,28.83
  Bottom 0.61: v14.61,21.21 v14.61,27.56
N$11  (via drill 0.5 pad 1.68, 0.5 pad 1.93)
  Top 0.813: R302.1 Q302.2
  other vias: 16.51,52.96 16.51,49.78
N$12  (via drill 0.5 pad 1.68, 0.5 pad 1.93)
  Top 0.813: R304.1 Q304.2
  other vias: 26.67,52.96 26.67,49.78
N$13  (via drill 0.5 pad 1.68, 0.5 pad 1.93)
  Top 0.813: R303.1 Q303.2
  other vias: 21.59,52.96 21.59,49.78
N$14  (via drill 0.5 pad 1.42, 0.5 pad 1.68)
  Top 0.61: IC302.13 v22.23,27.56
  Bottom 0.61: v22.23,27.56 22.23,37.72 22.86,38.35 24.13,38.35 26.67,40.89 R304.2
  other vias: 26.67,44.7
N$15
  Top 0.61: IC302.10 26.04,28.19 27.3,29.46 | 27.3,29.46 27.94,30.1 IC306.7 | R308.1 30.48,28.83 29.84,28.19 28.57,28.19 27.3,29.46
N$16  (via drill 0.5 pad 1.42, 0.5 pad 1.68)
  Top 0.61: IC302.1 v20.95,21.21
  Bottom 0.61: v20.95,21.21 20.95,38.35 21.59,38.99 R303.2
  other vias: 21.59,44.7
N$17  (via drill 0.5 pad 1.68)
  Top 0.61: 27.94,40.26 26.99,40.26 C304.1 | 27.94,40.26 IC306.2 | 27.94,40.26 R312.1
  other vias: 28.57,40.26
N$18  (via drill 0.5 pad 1.42)
  Top 0.61: v24.77,27.56 24.13,27.56 22.86,28.83 IC305.7 | IC302.4 v24.77,21.21
  Bottom 0.61: v24.77,21.21 v24.77,27.56 26.04,28.83 R307.1
N$19  (via drill 0.5 pad 1.68)
  Top 0.61: 22.86,40.26 21.91,40.26 C303.1 | 22.86,40.26 IC305.2 | 22.86,40.26 R311.1
  other vias: 23.5,40.26
N$20  (via drill 0.5 pad 1.68)
  Top 0.61: 17.78,40.26 16.83,40.26 C302.1 | 17.78,40.26 IC304.2 | 17.78,40.26 R310.1
  other vias: 18.41,40.26
N$21  (via drill 0.5 pad 3.81)
  other vias: 6.5,64.22
N$22  (via drill 0.5 pad 1.68)
  Top 0.61: 12.7,40.26 11.75,40.26 C301.1 | 12.7,40.26 IC303.2 | 12.7,40.26 R309.1
  other vias: 13.34,40.26
N$48  (via drill 0.5 pad 3.81)
  other vias: 143.5,64.22
N$49  (via drill 0.5 pad 3.81)
  other vias: 6.5,12.71
N$50  (via drill 0.5 pad 3.81)
  other vias: 143.5,12.71
TR_CLK  (via drill 0.5 pad 2.54)
  Top 0.61: 14.61,22.48 IC301.11 | 13.34,22.48 IC301.3 | 14.61,22.48 23.5,22.48 | 23.5,22.48 24.77,22.48 | 24.77,22.48 IC302.11 | 23.5,22.48 IC302.3 | R201.2 7.37,22.48 13.34,22.48 | 24.77,22.48 33.02,22.48 | 13.34,22.48 14.61,22.48
  other vias: 6.86,22.99
VCC  (via drill 0.5 pad 1.68, 0.5 pad 2.18)  (2 unrouted)
  Top 0.813: D402.A 12.06,67.56 11.43,68.2 11.43,72.64 12.06,73.28 20.95,73.28 | D405.A 29.84,67.56 30.48,68.2 30.48,73.28
  Top 2.184: SV402.6 SV402.5 20.95,73.28 | SV401.6 SV401.5 42.55,73.28 | SV403.6 SV403.5 64.14,73.28 | SV404.6 SV404.5 85.72,73.28 | 128.91,73.28 SV406.5 SV406.6 | SV405.6 SV405.5 107.31,73.28
  Top 2.54: 12.7,73.28 20.95,73.28 30.48,73.28 42.55,73.28 64.14,73.28 85.72,73.28 107.31,73.28 128.91,73.28 135.25,73.28 137.16,71.37 137.16,62.48 v145.41,54.23
  Bottom 2.184: SV101.6 SV101.5 20.95,5.97 22.23,4.7 | 42.55,4.7 SV102.6 | 64.14,4.7 SV103.6 | 85.72,4.7 SV104.5 SV104.6 | 107.31,4.7 SV105.5 SV105.6 | SV106.6 SV106.5 128.91,4.7
  Bottom 2.54: 22.23,4.7 42.55,4.7 64.14,4.7 85.72,4.7 107.31,4.7 128.91,4.7 135.89,4.7 137.16,5.97 137.16,14.86 145.41,22.48 v145.41,54.23
  other vias: 13.34,67.56 28.57,67.56
~0.5V  (via drill 0.5 pad 1.68)
  Top 0.61: IC201.3 5.08,37.72 3.81,38.99 3.81,40.89 4.45,41.53 R203.2
  other vias: 8.26,41.53

### Text on the board
tPlace: P_GND | +5V | TR_CLK | OC3C | PE5_INT5 | S_GND